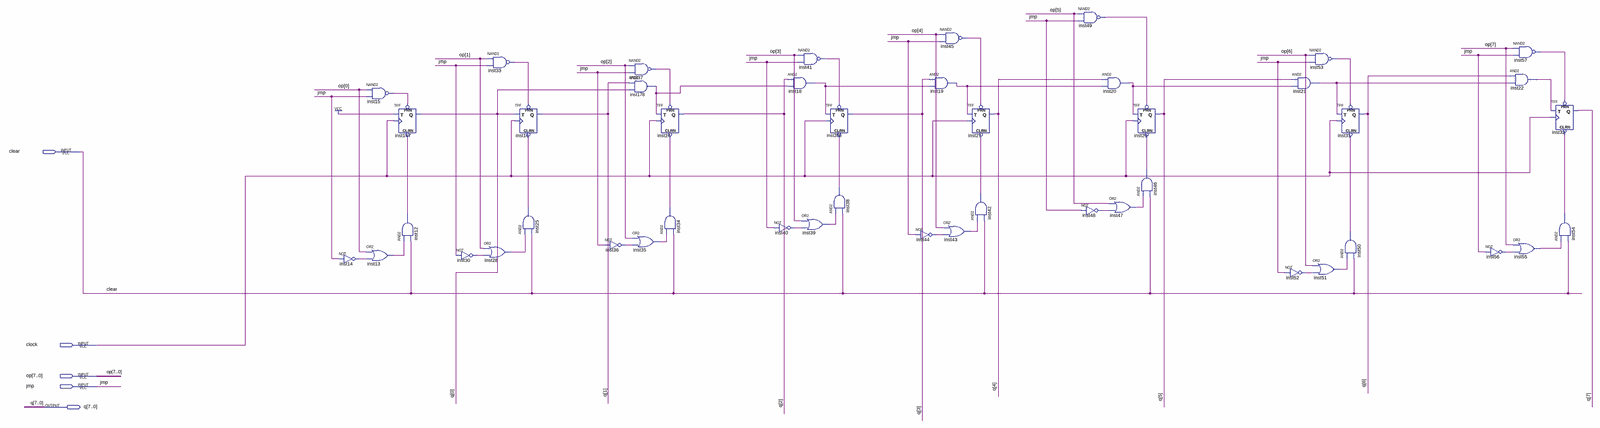
[diagram p0: schematic sheet, whole]
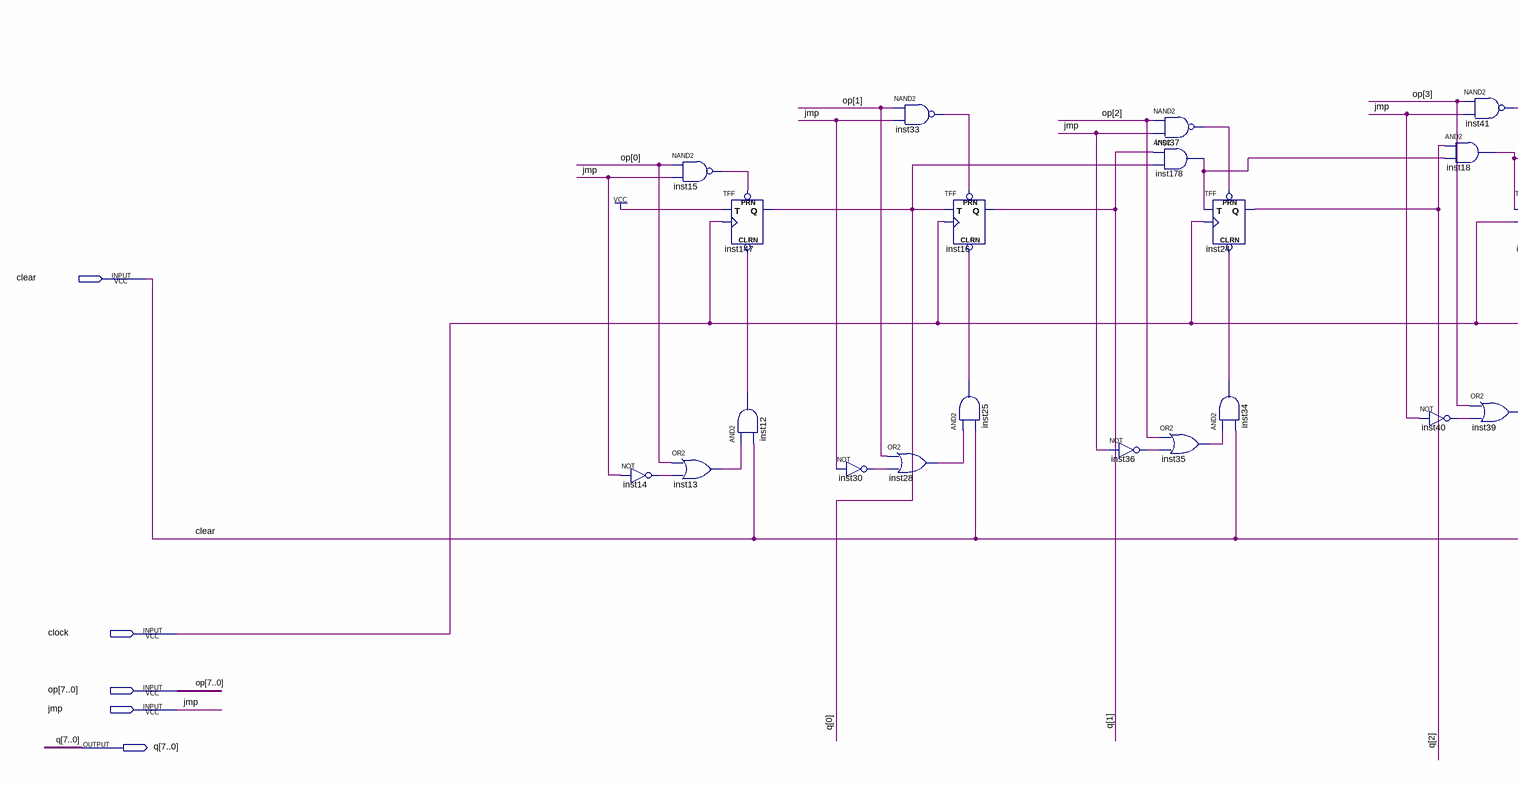
[diagram p1: schematic sheet, left part]
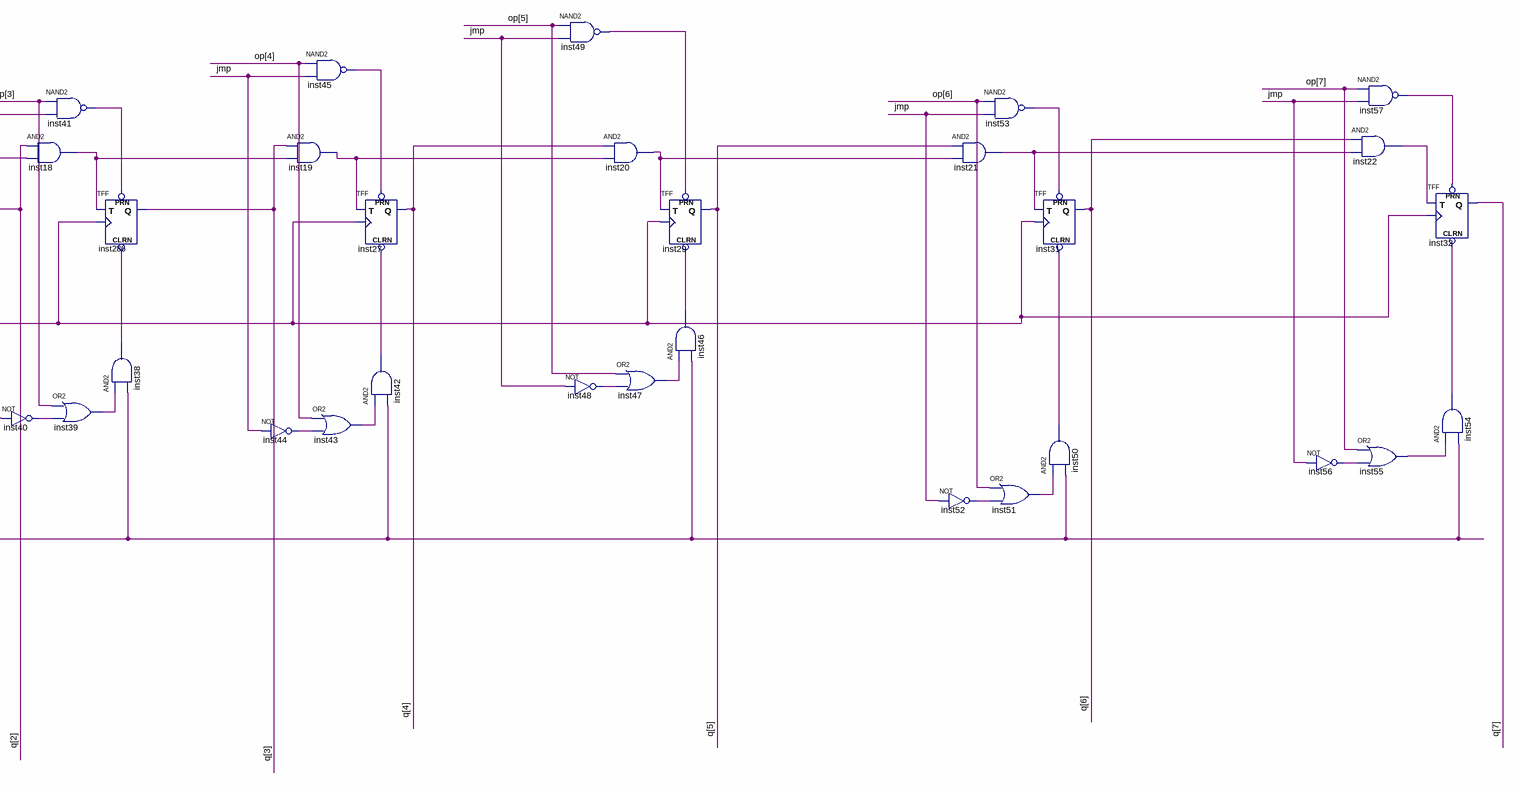
[diagram p2: schematic sheet, right part]
// Quartus schematic contador.bdf as structural Verilog: 46 symbols, 5 pins
module contador (
  input  clear,
  input  clock,
  input  [7:0] op,
  input  jmp,
  output [7:0] q
);

  wire inst12_out, inst13_out, inst14_out, inst15_out, inst18_out, inst19_out, inst20_out, inst21_out,
       inst22_out, inst25_out, inst28_out, inst30_out, inst33_out, inst34_out, inst35_out, inst36_out,
       inst37_out, inst38_out, inst39_out, inst40_out, inst41_out, inst42_out, inst43_out, inst44_out,
       inst45_out, inst46_out, inst47_out, inst48_out, inst49_out, inst50_out, inst51_out, inst52_out,
       inst53_out, inst54_out, inst55_out, inst56_out, inst57_out, inst178_out;

  not inst14 (inst14_out, jmp);
  nand inst15 (inst15_out, op[0], jmp);
  or inst13 (inst13_out, op[0], inst14_out);
  TFF inst147 (.PRN(inst15_out), .CLRN(inst12_out), .T(1'b1), .CLK(clock), .Q(q[0]));
  and inst12 (inst12_out, inst13_out, clear);
  not inst30 (inst30_out, jmp);
  nand inst33 (inst33_out, op[1], jmp);
  or inst28 (inst28_out, op[1], inst30_out);
  TFF inst16 (.PRN(inst33_out), .CLRN(inst25_out), .T(q[0]), .CLK(clock), .Q(q[1]));
  and inst25 (inst25_out, inst28_out, clear);
  not inst36 (inst36_out, jmp);
  nand inst37 (inst37_out, op[2], jmp);
  and inst178 (inst178_out, q[1], q[0]);
  or inst35 (inst35_out, op[2], inst36_out);
  TFF inst24 (.PRN(inst37_out), .CLRN(inst34_out), .T(inst178_out), .CLK(clock), .Q(q[2]));
  and inst34 (inst34_out, inst35_out, clear);
  not inst40 (inst40_out, jmp);
  nand inst41 (inst41_out, op[3], jmp);
  and inst18 (inst18_out, q[2], inst178_out);
  or inst39 (inst39_out, op[3], inst40_out);
  TFF inst286 (.PRN(inst41_out), .CLRN(inst38_out), .T(inst18_out), .CLK(clock), .Q(q[3]));
  and inst38 (inst38_out, inst39_out, clear);
  not inst44 (inst44_out, jmp);
  nand inst45 (inst45_out, op[4], jmp);
  and inst19 (inst19_out, q[3], inst18_out);
  or inst43 (inst43_out, op[4], inst44_out);
  TFF inst27 (.PRN(inst45_out), .CLRN(inst42_out), .T(inst19_out), .CLK(clock), .Q(q[4]));
  and inst42 (inst42_out, inst43_out, clear);
  nand inst49 (inst49_out, op[5], jmp);
  not inst48 (inst48_out, jmp);
  and inst20 (inst20_out, q[4], inst19_out);
  or inst47 (inst47_out, op[5], inst48_out);
  TFF inst29 (.PRN(inst49_out), .CLRN(inst46_out), .T(inst20_out), .CLK(clock), .Q(q[5]));
  and inst46 (inst46_out, inst47_out, clear);
  and inst21 (inst21_out, q[5], inst20_out);
  not inst52 (inst52_out, jmp);
  nand inst53 (inst53_out, op[6], jmp);
  or inst51 (inst51_out, op[6], inst52_out);
  TFF inst31 (.PRN(inst53_out), .CLRN(inst50_out), .T(inst21_out), .CLK(clock), .Q(q[6]));
  and inst50 (inst50_out, inst51_out, clear);
  not inst56 (inst56_out, jmp);
  nand inst57 (inst57_out, op[7], jmp);
  and inst22 (inst22_out, q[6], inst21_out);
  or inst55 (inst55_out, op[7], inst56_out);
  TFF inst32 (.PRN(inst57_out), .CLRN(inst54_out), .T(inst22_out), .CLK(clock), .Q(q[7]));
  and inst54 (inst54_out, inst55_out, clear);
endmodule
